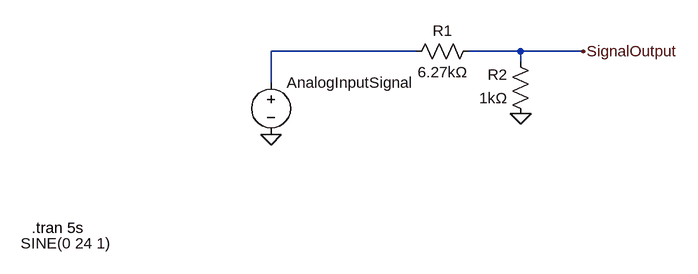
[diagram p0: schematic ADCStepDown.asc]
ADCStepDown.asc, the LTspice schematic file:
Version 4
SHEET 1 880 680
WIRE 224 96 0 96
WIRE 384 96 304 96
WIRE 480 96 384 96
WIRE 384 112 384 96
WIRE 0 144 0 96
FLAG 384 192 0
FLAG 0 224 0
FLAG 480 96 SignalOutput
SYMBOL res 320 80 R90
WINDOW 0 0 56 VBottom 2
WINDOW 3 32 56 VTop 2
SYMATTR InstName R1
SYMATTR Value 6.27kΩ
SYMBOL res 400 208 R180
WINDOW 0 36 76 Left 2
WINDOW 3 36 40 Left 2
SYMATTR InstName R2
SYMATTR Value 1kΩ
SYMBOL voltage 0 128 R0
WINDOW 123 0 0 Left 0
WINDOW 39 0 0 Left 0
WINDOW 3 -385 264 Left 2
SYMATTR Value SINE(0 24 1)
SYMATTR InstName AnalogInputSignal
TEXT -368 368 Left 2 !.tran 5s

The netlist it stands for:
* ADCStepDown.asc
R1 SignalOutput N001 6.27kΩ
R2 0 SignalOutput 1kΩ
V§AnalogInputSignal N001 0 SINE(0 24 1)
.tran 5s
.backanno
.end

* Results of the author's LTspice run, read from the files saved beside the schematic
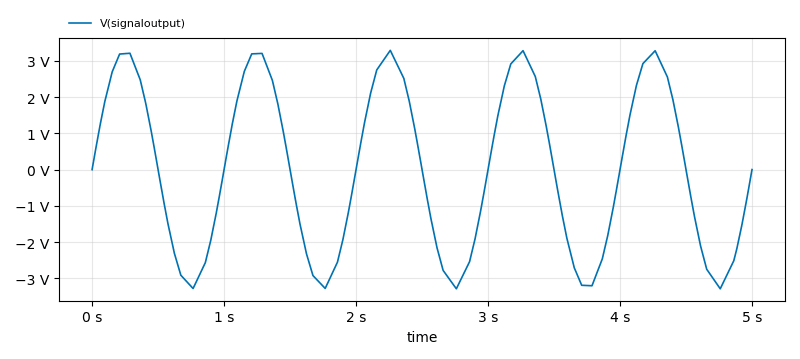
[diagram p1: Transient Analysis of ADCStepDown.asc, plotted from the saved traces]
* Transient Analysis, 1 run:
*   V(signaloutput): min -3.291 V, max 3.291 V, average 1.746 mV, rms 2.299 V, last 0 V